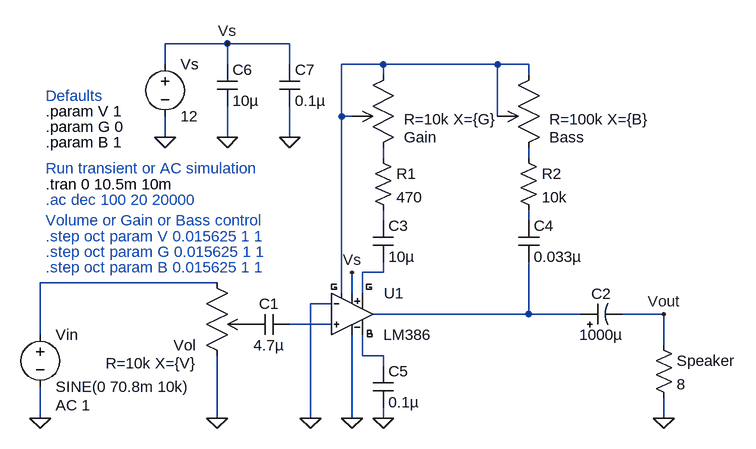
[diagram p0: schematic audio_amplifier.asc]
audio_amplifier.asc, the LTspice schematic file:
Version 4
SHEET 1 1020 680
WIRE 176 -224 80 -224
WIRE 272 -224 176 -224
WIRE 80 -192 80 -224
WIRE 176 -192 176 -224
WIRE 272 -192 272 -224
WIRE 416 -192 352 -192
WIRE 592 -192 416 -192
WIRE 640 -192 592 -192
WIRE 416 -176 416 -192
WIRE 640 -176 640 -192
WIRE 352 -112 352 -192
WIRE 368 -112 352 -112
WIRE 592 -112 592 -192
WIRE 80 -80 80 -112
WIRE 176 -80 176 -128
WIRE 272 -80 272 -128
WIRE 416 -48 416 -64
WIRE 640 -48 640 -64
WIRE 416 48 416 32
WIRE 640 48 640 32
WIRE 416 128 416 112
WIRE 416 128 384 128
WIRE 160 144 -112 144
WIRE 352 160 352 -112
WIRE 368 160 368 128
WIRE 384 160 384 128
WIRE 336 176 304 176
WIRE 640 192 640 112
WIRE 640 192 400 192
WIRE 720 192 640 192
WIRE 848 192 784 192
WIRE 336 208 272 208
WIRE -112 224 -112 144
WIRE 848 240 848 192
WIRE 384 256 384 224
WIRE 416 256 384 256
WIRE 416 272 416 256
WIRE -112 352 -112 304
WIRE 160 352 160 256
WIRE 304 352 304 176
WIRE 368 352 368 224
WIRE 416 352 416 336
WIRE 848 352 848 320
FLAG 368 352 0
FLAG 160 352 0
FLAG 304 352 0
FLAG 80 -80 0
FLAG 176 -80 0
FLAG 272 -80 0
FLAG 416 352 0
FLAG 848 352 0
FLAG -112 352 0
FLAG 176 -224 Vs
FLAG 368 128 Vs
FLAG 848 192 Vout
SYMBOL LM386 368 128 R0
SYMATTR InstName U1
SYMBOL cap 272 192 R90
WINDOW 0 0 32 VBottom 2
WINDOW 3 32 32 VTop 2
SYMATTR InstName C1
SYMATTR Value 4.7µ
SYMATTR SpiceLine V=25
SYMBOL voltage -112 208 R0
WINDOW 123 24 124 Left 2
WINDOW 39 0 0 Left 2
SYMATTR Value2 AC 1
SYMATTR InstName Vin
SYMATTR Value SINE(0 70.8m 10k)
SYMBOL voltage 80 -208 R0
WINDOW 123 0 0 Left 2
WINDOW 39 0 0 Left 2
SYMATTR InstName Vs
SYMATTR Value 12
SYMBOL cap 160 -192 R0
SYMATTR Value 10µ
SYMATTR InstName C6
SYMATTR SpiceLine V=25
SYMBOL cap 256 -192 R0
SYMATTR InstName C7
SYMATTR Value 0.1µ
SYMATTR SpiceLine V=25
SYMBOL cap 400 272 R0
SYMATTR InstName C5
SYMATTR Value 0.1µ
SYMATTR SpiceLine V=25
SYMBOL polcap 720 208 R270
WINDOW 0 32 32 VTop 2
WINDOW 3 0 32 VBottom 2
SYMATTR InstName C2
SYMATTR Value 1000µ
SYMATTR Description Capacitor
SYMATTR Type cap
SYMATTR SpiceLine V=25
SYMBOL res 832 224 R0
SYMATTR InstName Speaker
SYMATTR Value 8
SYMBOL pot 176 240 R180
WINDOW 39 48 -28 Left 2
SYMATTR SpiceLine R=10k X={V}
SYMATTR InstName Vol
SYMBOL pot 624 -80 M180
WINDOW 39 48 28 Left 2
SYMATTR SpiceLine R=100k X={B}
SYMATTR InstName Bass
SYMBOL cap 400 48 R0
SYMATTR InstName C3
SYMATTR Value 10µ
SYMATTR SpiceLine V=25
SYMBOL pot 400 -80 M180
WINDOW 39 48 28 Left 2
SYMATTR SpiceLine R=10k X={G}
SYMATTR InstName Gain
SYMBOL cap 624 48 R0
SYMATTR InstName C4
SYMATTR Value 0.033µ
SYMATTR SpiceLine V=25
SYMBOL res 624 -64 R0
SYMATTR InstName R2
SYMATTR Value 10k
SYMATTR SpiceLine tol=5 pwr=63mW
SYMBOL res 400 -64 R0
SYMATTR InstName R1
SYMATTR Value 470
SYMATTR SpiceLine tol=5 pwr=63m
TEXT -104 -120 Left 2 !.param V 1
TEXT -104 120 Left 2 ;.step oct param B 0.015625 1 1
TEXT -104 -72 Left 2 !.param B 1
TEXT -104 -96 Left 2 !.param G 0
TEXT -104 96 Left 2 ;.step oct param G 0.015625 1 1
TEXT -104 -8 Left 2 !.tran 0 10.5m 10m
TEXT -104 -32 Left 2 ;Run transient or AC simulation
TEXT -104 -144 Left 2 ;Defaults
TEXT -104 16 Left 2 ;.ac dec 100 20 20000
TEXT -104 72 Left 2 ;.step oct param V 0.015625 1 1
TEXT -104 48 Left 2 ;Volume or Gain or Bass control

The netlist it stands for:
* audio_amplifier.asc
XU1 N001 0 N009 0 N008 Vs N010 N006 LM386  ; pins G In- In+ V- OUT V+ B G8
C1 N009 P001 4.7µ V=25
Vin N007 0 SINE(0 70.8m 10k) AC 1
Vs Vs 0 12
C6 Vs 0 10µ V=25
C7 Vs 0 0.1µ V=25
C5 N010 0 0.1µ V=25
C2 N008 Vout 1000µ V=25
R§Speaker Vout 0 8
XVol 0 P001 N007 pot R=10k X={V}  ; pins 1 2 3
XBass N003 N001 N001 pot R=100k X={B}  ; pins 1 2 3
C3 N004 N006 10µ V=25
XGain N002 N001 N001 pot R=10k X={G}  ; pins 1 2 3
C4 N005 N008 0.033µ V=25
R2 N003 N005 10k tol=5 pwr=63mW
R1 N002 N004 470 tol=5 pwr=63m
.param V 1
* .step oct param B 0.015625 1 1
.param B 1
.param G 0
* .step oct param G 0.015625 1 1
.tran 0 10.5m 10m
* Run transient or AC simulation
* Defaults
* .ac dec 100 20 20000
* .step oct param V 0.015625 1 1
* Volume or Gain or Bass control
.lib LM386.lib
.backanno
.end